# Altium project Collector Robot Motherboard.PrjPcb
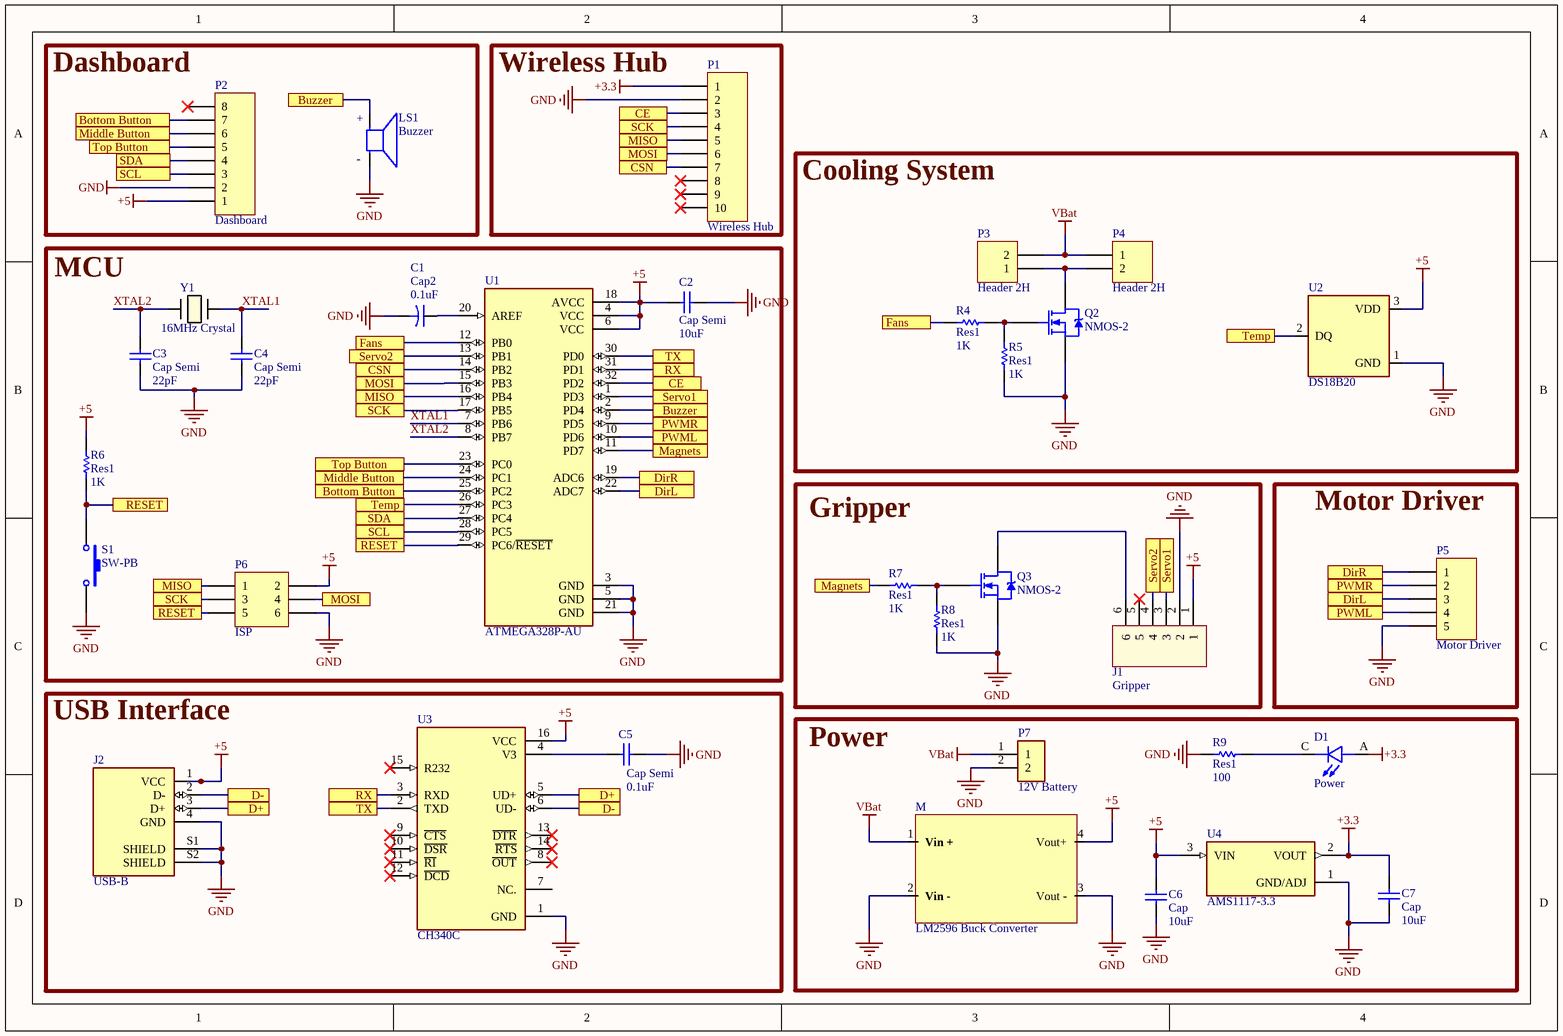
[diagram p0: Sheet1.SchDoc]
1 sheet, 33 parts. Net scope: flat (ports and power ports of the same name join across sheets).
Board file: PCB1.PcbDoc

## Sheet Sheet1.SchDoc
size A4; SheetNumber: 1; SheetTotal: 1; SPICEModelCacheEBBFLUWG: <root> / <DocumentId>EBBFLUWG</DocumentId> / <CacheFrame Number="0"> / <Model Name="cap" Kind="MDL"> / <Text>*Default semiconductor capacitor / .MODEL CAP C()</Text> / </Model> / </CacheFrame> / </root>

### Parts
C1  Cap2  value 0.1uF  [CAPR5-4X5]
C2  Cap Semi  value 10uF  [C1210]
C3  Cap Semi  value 22pF  [1608[0603]]
C4  Cap Semi  value 22pF  [1608[0603]]
C5  Cap Semi  value 0.1uF  [C1206]
C6  Cap  value 10uF  [C1206]
C7  Cap  value 10uF  [C1206]
D1  Power  [LEDRD254W57D500H1070]
J1  Gripper  [TE_282836-6]
J2  USB-B  [SAMTEC_USB-B-S-X-X-TH]
LS1  Buzzer  [XDCR_AI-1223-TWT-12V-R]
M  LM2596 Buck Converter  [PCBComponent_1]
P1  Wireless Hub  [HDR1X10]
P2  Dashboard  [HDR1X8]
P3  Header 2H  [HDR1X2H]
P4  Header 2H  [HDR1X2H]
P5  Motor Driver  [HDR1X5H]
P6  ISP  [HDR2X3]
P7  12V Battery  [TE_282837-2]
Q2  NMOS-2  [SM3113]
Q3  NMOS-2  [SM3113]
R4  Res1  value 1K  [AXIAL-0.3]
R5  Res1  value 1K  [AXIAL-0.3]
R6  Res1  value 1K  [AXIAL-0.3]
R7  Res1  value 1K  [AXIAL-0.3]
R8  Res1  value 1K  [AXIAL-0.3]
R9  Res1  value 100  [AXIAL-0.3]
S1  SW-PB  [SW_TL3305AF160QG]
U1  ATMEGA328P-AU  [QFP80P900X900X120-32N]
U2  DS18B20  [TO-92-TO92127P495H2044-3]
U3  CH340C  [SOIC127P600X180-16N]
U4  AMS1117-3.3  [SOT229P700X180-4N]
Y1  16MHz Crystal  [H32_RAM]

### Blocks framed on the sheet
Dashboard: LS1 P2
Wireless Hub: P1
Cooling System: P3 P4 Q2 R4 R5 U2
MCU: C1-C4 P6 R6 S1 U1 Y1
Gripper: J1 Q3 R7 R8
Motor Driver: P5
USB Interface: C5 J2 U3
Power: C6 C7 D1 M P7 R9 U4

### Ports
Bottom Button (see Sheet1[1A]), Bottom Button (see Sheet1[1B]), Buzzer (see Sheet1[1A]), Buzzer (see Sheet1[2B]), CE (see Sheet1[2A]), CE (see Sheet1[2B]), CSN (see Sheet1[1B]), CSN (see Sheet1[2A]), D+ (see Sheet1[1D]), D+ (see Sheet1[2D]), D- (see Sheet1[1D]), D- (see Sheet1[2D]), DirL (see Sheet1[2B]), DirL (see Sheet1[4C]), DirR (see Sheet1[2B]), DirR (see Sheet1[4C]), Fans (see Sheet1[1B]), Fans (see Sheet1[3B]), Magnets (see Sheet1[2B]), Magnets (see Sheet1[3C]), Middle Button (see Sheet1[1A]), Middle Button (see Sheet1[1B]), MISO (see Sheet1[1B], Sheet1[1C]), MISO (see Sheet1[1B], Sheet1[2A]), MISO (see Sheet1[1C], Sheet1[2A]), MOSI (see Sheet1[1B], Sheet1[1C]), MOSI (see Sheet1[1B], Sheet1[2A]), MOSI (see Sheet1[1C], Sheet1[2A]), PWML (see Sheet1[2B]), PWML (see Sheet1[4C]), PWMR (see Sheet1[2B]), PWMR (see Sheet1[4C]), RESET (see Sheet1[1B], Sheet1[1C]), RESET (see Sheet1[1C]), RX (see Sheet1[1D]), RX (see Sheet1[2B]), SCK (see Sheet1[1B], Sheet1[1C]), SCK (see Sheet1[1B], Sheet1[2A]), SCK (see Sheet1[1C], Sheet1[2A]), SCL (see Sheet1[1A]), SCL (see Sheet1[1C]), SDA (see Sheet1[1A]), SDA (see Sheet1[1C]), Servo1 (see Sheet1[2B]), Servo1 (see Sheet1[3C]), Servo2 (see Sheet1[1B]), Servo2 (see Sheet1[3C]), Temp (see Sheet1[1B]), Temp (see Sheet1[4B]), Top Button (see Sheet1[1A]), Top Button (see Sheet1[1B]), TX (see Sheet1[1D]), TX (see Sheet1[2B])

### Nets
+3.3: C7.1 D1.A P1.1 U4.2(VOUT)
+5: C2.1 C6.1 J1.1 J2.1(VCC) M.4(Vout+) P2.1 P6.2 R6.2 U1.4(VCC) U1.6(VCC) U1.18(AVCC) U2.3(VDD) U3.16(VCC) U4.3(VIN)
GND: C1.2 C2.2 C3.2 C4.2 C5.2 C6.2 C7.2 J1.2 J2.4(GND) J2.S1(SHIELD) J2.S2(SHIELD) LS1.N(NEG) M.2(Vin_-) M.3(Vout_-) P1.2 P2.2 P5.5 P6.6 P7.2 Q2.3(S) Q3.3(S) R5.1 R8.1 R9.2 S1.3,4 U1.3(GND) U1.5(GND) U1.21(GND) U2.1(GND) U3.1(GND) U4.1(GND/ADJ)
VBat: M.1(Vin_+) P3.2 P4.1 P7.1
XTAL1: C4.1 U1.7(PB6) Y1.2
XTAL2: C3.1 U1.8(PB7) Y1.1
NetC1_1: C1.1 U1.20(AREF)
NetC5_1: C5.1 U3.4(V3)
NetD1_C: D1.C R9.1
NetJ1_3: J1.3 U1.1(PD3) ; port Servo1
NetJ1_4: J1.4 U1.13(PB1) ; port Servo2
NetJ1_6: J1.6 Q3.2(D)
NetJ2_2: J2.2(D-) U3.6(UD-) ; port D-
NetJ2_3: J2.3(D+) U3.5(UD+) ; port D+
NetLS1_P: LS1.P(POS) U1.2(PD4) ; port Buzzer
NetP1_3: P1.3 U1.32(PD2) ; port CE
NetP1_4: P1.4 P6.3 U1.17(PB5) ; port SCK
NetP1_5: P1.5 P6.1 U1.16(PB4) ; port MISO
NetP1_6: P1.6 P6.4 U1.15(PB3) ; port MOSI
NetP1_7: P1.7 U1.14(PB2) ; port CSN
NetP2_3: P2.3 U1.28(PC5) ; port SCL
NetP2_4: P2.4 U1.27(PC4) ; port SDA
NetP2_5: P2.5 U1.23(PC0) ; port Top Button
NetP2_6: P2.6 U1.24(PC1) ; port Middle Button
NetP2_7: P2.7 U1.25(PC2) ; port Bottom Button
NetP3_1: P3.1 P4.2 Q2.2(D)
NetP5_1: P5.1 U1.19(ADC6) ; port DirR
NetP5_2: P5.2 U1.9(PD5) ; port PWMR
NetP5_3: P5.3 U1.22(ADC7) ; port DirL
NetP5_4: P5.4 U1.10(PD6) ; port PWML
NetP6_5: P6.5 R6.1 S1.1,2 U1.29(PC6/~{RESET}) ; port RESET
NetQ2_1: Q2.1(G) R4.1 R5.2
NetQ3_1: Q3.1(G) R7.1 R8.2
NetR4_2: R4.2 U1.12(PB0) ; port Fans
NetR7_2: R7.2 U1.11(PD7) ; port Magnets
NetU1_26: U1.26(PC3) U2.2(DQ) ; port Temp
NetU1_30: U1.30(PD0) U3.2(TXD) ; port TX
NetU1_31: U1.31(PD1) U3.3(RXD) ; port RX

Not connected (* = marked no-connect by the designer): J1 5*; P1 8* 9* 10*; P2 8*; U3 7(NC.) 8(~{OUT})* 9(~{CTS})* 10(~{DSR})* 11(~{RI})* 12(~{DCD})* 13(~{DTR})* 14(~{RTS})* 15(R232)*

### Notes on the sheet
- (in symbol AI-1223-TWT-12V-R) +; -

### Library data of the parts
C1 = Cap2: Capacitor; Published: 23-Sep-2002; PackageReference: CAPR5-4X5; Publisher: Altium Limited; PackageDescription: Capacitor; 2 Leads
C2-C7 = Cap Semi: Capacitor (Semiconductor SIM Model); Published: 8-Jun-2000; LatestRevisionDate: 29-May-2009; LatestRevisionNote: IPC-7351 Footprint Added.; PackageReference: C1206; Publisher: Altium Limited; PackageDescription: Chip Capacitor
D1 = L08R5000Q1: LED, 5MM, ORANGE; LED / Lamp Size: 5mm / T-1 3/4; LED Colour: Orange; Typ Luminous Intensity: 4.3mcd; Viewing Angle: ...; MF: LED Technology; Value: *; SnapEDA_Link: https://www.snapeda.com/parts/L08R5000Q1/LED+Technology/view-part/?ref=snap; MP: L08R5000Q1; Check_prices: https://www.snapeda.com/parts/L08R5000Q1/LED+Technology/view-part/?ref=eda; Availability: In Stock; Price: None; Package: None
J1 = 282836-6: Wire to Board 6 Position 5 mm Pitch 30-16 AWG Euro Style Terminal Block; MF: TE Connectivity; EU_RoHS_Compliance: Compliant with Exemptions; Purchase-URL: https://pricing.snapeda.com/search/part/282836-6/?ref=eda; Package: None; MP: 282836-6; Value: *; SnapEDA_Link: https://www.snapeda.com/parts/282836-6/TE+Connectivity+AMP+Connectors/view-part/?ref=snap; Digi-Key_Part_Number: A98339-ND; Check_prices: https://www.snapeda.com/parts/282836-6/TE+Connectivity+AMP+Connectors/view-part/?ref=eda
J2 = USB-B-S-X-X-TH: USB-B (USB TYPE-B) USB 2.0 Receptacle Connector 4 Position Through Hole, Right Angle; MP: USB-B-S-S-B-TH; MF: Samtec; Digi-Key_Part_Number: SAM10869-ND; Check_prices: https://www.snapeda.com/parts/USB-B-S-S-B-TH/Samtec+Inc./view-part/?ref=eda; Package: None; SnapEDA_Link: https://www.snapeda.com/parts/USB-B-S-S-B-TH/Samtec+Inc./view-part/?ref=snap; Value: *; Purchase-URL: https://pricing.snapeda.com/search/part/USB-B-S-S-B-TH/?ref=eda
LS1 = AI-1223-TWT-12V-R: ELECTRO-MECHANICAL AUDIO INDICATOR; MF: PUI Audio,; SnapEDA_Link: https://www.snapeda.com/parts/AI-1223-TWT-12V-R/PUI+Audio%252C+Inc./view-part/?ref=snap; Package: None; MP: AI-1223-TWT-12V-R; Check_prices: https://www.snapeda.com/parts/AI-1223-TWT-12V-R/PUI+Audio%252C+Inc./view-part/?ref=eda; Purchase-URL: https://pricing.snapeda.com/search/part/AI-1223-TWT-12V-R/?ref=eda; Price: None; Value: *; Availability: In Stock
P1 = Header 10: Header, 10-Pin; LatestRevisionDate: 17-Jul-2002; LatestRevisionNote: Re-released for DXP Platform.; Publisher: Altium Limited
P2 = Header 8: Header, 8-Pin; LatestRevisionDate: 17-Jul-2002; LatestRevisionNote: Re-released for DXP Platform.; Publisher: Altium Limited
P3 P4 = Header 2H: Header, 2-Pin, Right Angle; LatestRevisionDate: 17-Jul-2002; LatestRevisionNote: Re-released for DXP Platform.; Publisher: Altium Limited
P5 = Header 5H: Header, 5-Pin, Right Angle; LatestRevisionDate: 17-Jul-2002; LatestRevisionNote: Re-released for DXP Platform.; Publisher: Altium Limited
P6 = Header 3X2: Header, 3-Pin, Dual row; LatestRevisionDate: 17-Jul-2002; LatestRevisionNote: Re-released for DXP Platform.; Publisher: Altium Limited
P7 = 282837-2: Ð Ð°Ð·ÑŠÐµÐ¼Ð½Ñ‹Ðµ ÐºÐ»ÐµÐ¼Ð¼Ð½Ñ‹Ðµ ÐºÐ¾Ð»Ð¾Ð´ÐºÐ¸ Ð Ð¾Ð·ÐµÑ‚ÐºÐ° 2 Ð¿Ð¾Ð»Ð¾Ð¶ÐµÐ½Ð¸Ñ 5,08 Ð¼Ð¼ ÐŸÑ€Ð¸Ð¿Ð¾Ð¹ Ð¿Ñ€ÑÐ¼Ð¾Ð¹ Ñ‡ÐµÑ€ÐµÐ· Ð¾Ñ‚Ð²ÐµÑ€ÑÑ‚Ð¸Ðµ 13,5 Ð / ÐºÐ¾Ð½Ñ‚Ð°ÐºÑ‚; MF: TE Connectivity; SnapEDA_Link: https://www.snapeda.com/parts/282837-2/TE+Connectivity+AMP+Connectors/view-part/?ref=snap; Price: None; Check_prices: https://www.snapeda.com/parts/282837-2/TE+Connectivity+AMP+Connectors/view-part/?ref=eda; Purchase-URL: https://pricing.snapeda.com/search/part/282837-2/?ref=eda; MP: 282837-2; Value: *; Availability: In Stock; Package: None
Q2 Q3 = NMOS-2: N-Channel Power MOSFET; Note: Pin 2 is electrically connected to pin 4.; Published: 8-Jun-2000; LatestRevisionDate: 17-Jul-2002; LatestRevisionNote: Re-released for DXP Platform.; DatasheetVersion: PD-9.814; PackageVersion: Feb-1997; PackageReference: TO-220AB; Publisher: Altium Limited; PackageDescription: TO, Thru-Hole, Vertical, Heatsink Mounted; 3 In-Line Leads; Pitch 2.54 mm; ComponentLink1Description: Manufacturer Link; ComponentLink1URL: http://www.irf.com/
R4-R9 = Res1: Resistor; Published: 8-Jun-2000; LatestRevisionDate: 17-Jul-2002; LatestRevisionNote: Re-released for DXP Platform.; PackageReference: AXIAL-0.3; Publisher: Altium Limited; PackageDescription: Axial Device, Thru-Hole; 2 Leads; 0.3 in Pin Spacing
S1 = SW-PB: Switch; Published: 24-Mar-1999; LatestRevisionDate: 17-Jul-2002; LatestRevisionNote: Re-released for DXP Platform.; PackageReference: SPST-2; Publisher: Altium Limited; PackageDescription: Switch; 2 Leads
U1 = ATMEGA328P-AU: AVR AVRÂ® ATmega Microcontroller IC 8-Bit 20MHz 32KB (16K x 16) FLASH 32-TQFP (7x7); MF: Microchip Technology; Value: *; SnapEDA_Link: https://www.snapeda.com/parts/ATMEGA328P-AU/Microchip/view-part/?ref=snap; MP: ATMEGA328P-AU; Purchase-URL: https://pricing.snapeda.com/search/part/ATMEGA328P-AU/?ref=eda; Check_prices: https://www.snapeda.com/parts/ATMEGA328P-AU/Microchip/view-part/?ref=eda; Availability: In Stock; Price: None; Package: TQFP-32 Microchip
U2 = DS18B20: Temperature Sensor Digital, Local -55Â°C ~ 125Â°C 12 b 8-uMAX-EP¦8-uSOP-EP; MF: Maxim; Value: *; SnapEDA_Link: https://www.snapeda.com/parts/DS18B20/Maxim+Integrated/view-part/?ref=snap; Purchase-URL: https://pricing.snapeda.com/search/part/DS18B20/?ref=eda; Availability: In Stock; Price: None; Package: TO-226-3 Maxim; Check_prices: https://www.snapeda.com/parts/DS18B20/Maxim+Integrated/view-part/?ref=eda; MP: DS18B20
U3 = CH340C: USB to serial chip CH340; MF: WCH; Price: None; Availability: Not in stock; MP: CH340C; Package: None; SnapEDA_Link: https://www.snapeda.com/parts/CH340C/WCH/view-part/?ref=snap; Check_prices: https://www.snapeda.com/parts/CH340C/WCH/view-part/?ref=eda; Value: *
U4 = AMS1117-3.3: Sot223/Pkg 1-Amp 3.3-Volt Low Drop Out Voltage Regulatator; MF: Advanced Monolithic Systems; Value: *; SnapEDA_Link: https://www.snapeda.com/parts/AMS1117-3.3/Advanced+Monolithic+Systems/view-part/?ref=snap; Availability: Not in stock; Price: None; Package: SOT-223 Seeed Technology; Check_prices: https://www.snapeda.com/parts/AMS1117-3.3/Advanced+Monolithic+Systems/view-part/?ref=eda; MP: AMS1117-3.3
Y1 = HC49/US-10.244MHZ-16PF-30-EXT-SMD-H32-TR: No Description Available; Mfr_Name: Rami Technology; Copyright: Copyright (C) 2023 Ultra Librarian. All rights reserved.; Manufacturer_Part_Number: HC49/US-10.244MHZ-16PF-30-EXT-SMD-H32-TR; RefDes: RefDes; Type: DEV